# Altium schematic sheet ZynqPL_DDR.SchDoc: ZynqPL_DDR
size A3; Author: Carlos Barreiro; Organization: Escuela Técnica Superior de Ingeniería de Sistemas Informáticos de la Universidad Politécnica de Madrid; Address1: Campus Sur de la Universidad Politécnica de Madrid; Address2: Calle de Alan Turing, s/nº; Address3: Madrid 28031; Address4: España; DocumentNumber: 8; Revision: 1.0; SheetNumber: 8; SheetTotal: 16
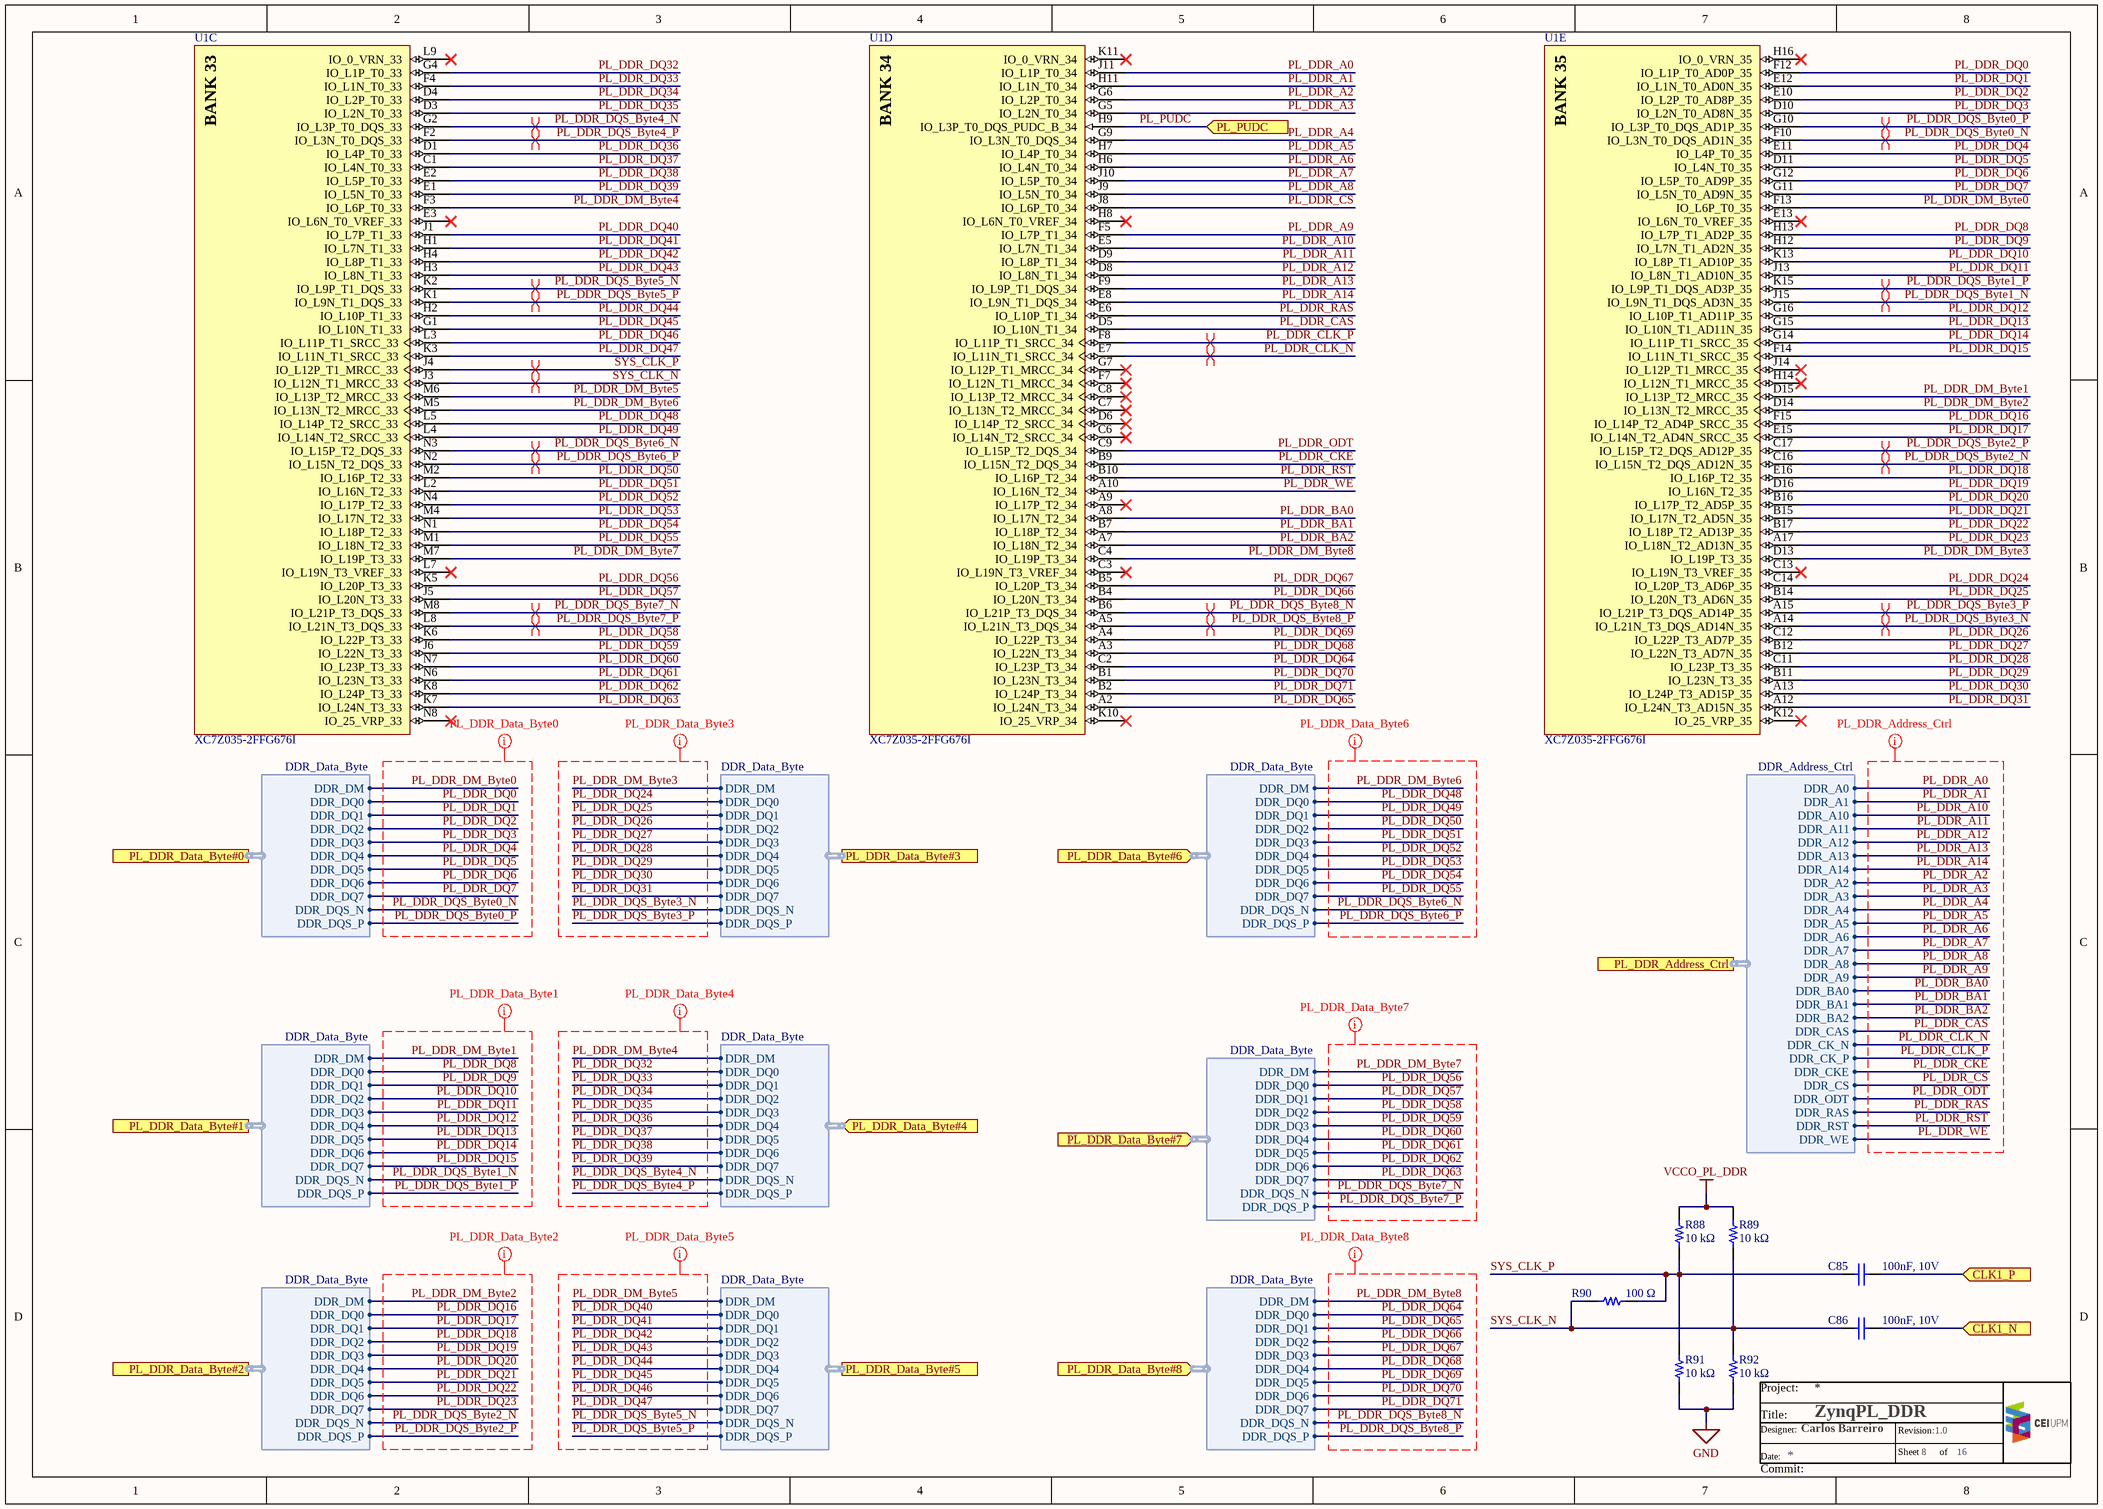
[diagram p0: ZynqPL_DDR.SchDoc]

## Parts
C85  100nF, 10V  [WURTH_WCAP-CSGP_0402]
C86  100nF, 10V  [WURTH_WCAP-CSGP_0402]
R88  10 kΩ  [PANASONIC_ERJ2G_0402]
R89  10 kΩ  [PANASONIC_ERJ2G_0402]
R90  100 Ω  [PANASONIC_ERJ2G_0402]
R91  10 kΩ  [PANASONIC_ERJ2G_0402]
R92  10 kΩ  [PANASONIC_ERJ2G_0402]
U1  XC7Z035-2FFG676I  [XILINX_FBG676]  (parts C,D,E of 13)

## Ports
CLK1_N (in), CLK1_P (in), PL_DDR_Address_Ctrl (harness DDR_Address_Ctrl), PL_DDR_Data_Byte#0 (harness DDR_Data_Byte), PL_DDR_Data_Byte#1 (harness DDR_Data_Byte), PL_DDR_Data_Byte#2 (harness DDR_Data_Byte), PL_DDR_Data_Byte#3 (harness DDR_Data_Byte), PL_DDR_Data_Byte#4 (in, harness DDR_Data_Byte), PL_DDR_Data_Byte#5 (harness DDR_Data_Byte), PL_DDR_Data_Byte#6 (in, harness DDR_Data_Byte), PL_DDR_Data_Byte#7 (in, harness DDR_Data_Byte), PL_DDR_Data_Byte#8 (in, harness DDR_Data_Byte), PL_PUDC (in)

## Harnesses
DDR_Data_Byte: DDR_DM, DDR_DQ0, DDR_DQ1, DDR_DQ2, DDR_DQ3, DDR_DQ4, DDR_DQ5, DDR_DQ6, DDR_DQ7, DDR_DQS_N, DDR_DQS_P
DDR_Address_Ctrl: DDR_A0, DDR_A1, DDR_A10, DDR_A11, DDR_A12, DDR_A13, DDR_A14, DDR_A2, DDR_A3, DDR_A4, DDR_A5, DDR_A6, DDR_A7, DDR_A8, DDR_A9, DDR_BA0, DDR_BA1, DDR_BA2, DDR_CAS, DDR_CK_N, DDR_CK_P, DDR_CKE, DDR_CS, DDR_ODT, DDR_RAS, DDR_RST, DDR_WE

## Nets
GND: R91.1 R92.1
VCCO_PL_DDR: R88.2 R89.2
CLK1_N: C86.2 ; port CLK1_N
CLK1_P: C85.2 ; port CLK1_P
PL_DDR_A0: U1.J11(IO_L1P_T0_34) ; port PL_DDR_Address_Ctrl.DDR_A0
PL_DDR_A1: U1.H11(IO_L1N_T0_34) ; port PL_DDR_Address_Ctrl.DDR_A1
PL_DDR_A2: U1.G6(IO_L2P_T0_34) ; port PL_DDR_Address_Ctrl.DDR_A2
PL_DDR_A3: U1.G5(IO_L2N_T0_34) ; port PL_DDR_Address_Ctrl.DDR_A3
PL_DDR_A4: U1.G9(IO_L3N_T0_DQS_34) ; port PL_DDR_Address_Ctrl.DDR_A4
PL_DDR_A5: U1.H7(IO_L4P_T0_34) ; port PL_DDR_Address_Ctrl.DDR_A5
PL_DDR_A6: U1.H6(IO_L4N_T0_34) ; port PL_DDR_Address_Ctrl.DDR_A6
PL_DDR_A7: U1.J10(IO_L5P_T0_34) ; port PL_DDR_Address_Ctrl.DDR_A7
PL_DDR_A8: U1.J9(IO_L5N_T0_34) ; port PL_DDR_Address_Ctrl.DDR_A8
PL_DDR_A9: U1.F5(IO_L7P_T1_34) ; port PL_DDR_Address_Ctrl.DDR_A9
PL_DDR_A10: U1.E5(IO_L7N_T1_34) ; port PL_DDR_Address_Ctrl.DDR_A10
PL_DDR_A11: U1.D9(IO_L8P_T1_34) ; port PL_DDR_Address_Ctrl.DDR_A11
PL_DDR_A12: U1.D8(IO_L8N_T1_34) ; port PL_DDR_Address_Ctrl.DDR_A12
PL_DDR_A13: U1.F9(IO_L9P_T1_DQS_34) ; port PL_DDR_Address_Ctrl.DDR_A13
PL_DDR_A14: U1.E8(IO_L9N_T1_DQS_34) ; port PL_DDR_Address_Ctrl.DDR_A14
PL_DDR_BA0: U1.A8(IO_L17N_T2_34) ; port PL_DDR_Address_Ctrl.DDR_BA0
PL_DDR_BA1: U1.B7(IO_L18P_T2_34) ; port PL_DDR_Address_Ctrl.DDR_BA1
PL_DDR_BA2: U1.A7(IO_L18N_T2_34) ; port PL_DDR_Address_Ctrl.DDR_BA2
PL_DDR_CAS: U1.D5(IO_L10N_T1_34) ; port PL_DDR_Address_Ctrl.DDR_CAS
PL_DDR_CKE: U1.B9(IO_L15N_T2_DQS_34) ; port PL_DDR_Address_Ctrl.DDR_CKE
PL_DDR_CLK_N: U1.E7(IO_L11N_T1_SRCC_34) ; port PL_DDR_Address_Ctrl.DDR_CK_N
PL_DDR_CLK_P: U1.F8(IO_L11P_T1_SRCC_34) ; port PL_DDR_Address_Ctrl.DDR_CK_P
PL_DDR_CS: U1.J8(IO_L6P_T0_34) ; port PL_DDR_Address_Ctrl.DDR_CS
PL_DDR_DM_Byte0: U1.F13(IO_L6P_T0_35) ; port PL_DDR_Data_Byte#0.DDR_DM
PL_DDR_DM_Byte1: U1.D15(IO_L13P_T2_MRCC_35) ; port PL_DDR_Data_Byte#1.DDR_DM
PL_DDR_DM_Byte2: U1.D14(IO_L13N_T2_MRCC_35) ; port PL_DDR_Data_Byte#2.DDR_DM
PL_DDR_DM_Byte3: U1.D13(IO_L19P_T3_35) ; port PL_DDR_Data_Byte#3.DDR_DM
PL_DDR_DM_Byte4: U1.F3(IO_L6P_T0_33) ; port PL_DDR_Data_Byte#4.DDR_DM
PL_DDR_DM_Byte5: U1.M6(IO_L13P_T2_MRCC_33) ; port PL_DDR_Data_Byte#5.DDR_DM
PL_DDR_DM_Byte6: U1.M5(IO_L13N_T2_MRCC_33) ; port PL_DDR_Data_Byte#6.DDR_DM
PL_DDR_DM_Byte7: U1.M7(IO_L19P_T3_33) ; port PL_DDR_Data_Byte#7.DDR_DM
PL_DDR_DM_Byte8: U1.C4(IO_L19P_T3_34) ; port PL_DDR_Data_Byte#8.DDR_DM
PL_DDR_DQ0: U1.F12(IO_L1P_T0_AD0P_35) ; port PL_DDR_Data_Byte#0.DDR_DQ0
PL_DDR_DQ1: U1.E12(IO_L1N_T0_AD0N_35) ; port PL_DDR_Data_Byte#0.DDR_DQ1
PL_DDR_DQ2: U1.E10(IO_L2P_T0_AD8P_35) ; port PL_DDR_Data_Byte#0.DDR_DQ2
PL_DDR_DQ3: U1.D10(IO_L2N_T0_AD8N_35) ; port PL_DDR_Data_Byte#0.DDR_DQ3
PL_DDR_DQ4: U1.E11(IO_L4P_T0_35) ; port PL_DDR_Data_Byte#0.DDR_DQ4
PL_DDR_DQ5: U1.D11(IO_L4N_T0_35) ; port PL_DDR_Data_Byte#0.DDR_DQ5
PL_DDR_DQ6: U1.G12(IO_L5P_T0_AD9P_35) ; port PL_DDR_Data_Byte#0.DDR_DQ6
PL_DDR_DQ7: U1.G11(IO_L5N_T0_AD9N_35) ; port PL_DDR_Data_Byte#0.DDR_DQ7
PL_DDR_DQ8: U1.H13(IO_L7P_T1_AD2P_35) ; port PL_DDR_Data_Byte#1.DDR_DQ0
PL_DDR_DQ9: U1.H12(IO_L7N_T1_AD2N_35) ; port PL_DDR_Data_Byte#1.DDR_DQ1
PL_DDR_DQ10: U1.K13(IO_L8P_T1_AD10P_35) ; port PL_DDR_Data_Byte#1.DDR_DQ2
PL_DDR_DQ11: U1.J13(IO_L8N_T1_AD10N_35) ; port PL_DDR_Data_Byte#1.DDR_DQ3
PL_DDR_DQ12: U1.G16(IO_L10P_T1_AD11P_35) ; port PL_DDR_Data_Byte#1.DDR_DQ4
PL_DDR_DQ13: U1.G15(IO_L10N_T1_AD11N_35) ; port PL_DDR_Data_Byte#1.DDR_DQ5
PL_DDR_DQ14: U1.G14(IO_L11P_T1_SRCC_35) ; port PL_DDR_Data_Byte#1.DDR_DQ6
PL_DDR_DQ15: U1.F14(IO_L11N_T1_SRCC_35) ; port PL_DDR_Data_Byte#1.DDR_DQ7
PL_DDR_DQ16: U1.F15(IO_L14P_T2_AD4P_SRCC_35) ; port PL_DDR_Data_Byte#2.DDR_DQ0
PL_DDR_DQ17: U1.E15(IO_L14N_T2_AD4N_SRCC_35) ; port PL_DDR_Data_Byte#2.DDR_DQ1
PL_DDR_DQ18: U1.E16(IO_L16P_T2_35) ; port PL_DDR_Data_Byte#2.DDR_DQ2
PL_DDR_DQ19: U1.D16(IO_L16N_T2_35) ; port PL_DDR_Data_Byte#2.DDR_DQ3
PL_DDR_DQ20: U1.B16(IO_L17P_T2_AD5P_35) ; port PL_DDR_Data_Byte#2.DDR_DQ4
PL_DDR_DQ21: U1.B15(IO_L17N_T2_AD5N_35) ; port PL_DDR_Data_Byte#2.DDR_DQ5
PL_DDR_DQ22: U1.B17(IO_L18P_T2_AD13P_35) ; port PL_DDR_Data_Byte#2.DDR_DQ6
PL_DDR_DQ23: U1.A17(IO_L18N_T2_AD13N_35) ; port PL_DDR_Data_Byte#2.DDR_DQ7
PL_DDR_DQ24: U1.C14(IO_L20P_T3_AD6P_35) ; port PL_DDR_Data_Byte#3.DDR_DQ0
PL_DDR_DQ25: U1.B14(IO_L20N_T3_AD6N_35) ; port PL_DDR_Data_Byte#3.DDR_DQ1
PL_DDR_DQ26: U1.C12(IO_L22P_T3_AD7P_35) ; port PL_DDR_Data_Byte#3.DDR_DQ2
PL_DDR_DQ27: U1.B12(IO_L22N_T3_AD7N_35) ; port PL_DDR_Data_Byte#3.DDR_DQ3
PL_DDR_DQ28: U1.C11(IO_L23P_T3_35) ; port PL_DDR_Data_Byte#3.DDR_DQ4
PL_DDR_DQ29: U1.B11(IO_L23N_T3_35) ; port PL_DDR_Data_Byte#3.DDR_DQ5
PL_DDR_DQ30: U1.A13(IO_L24P_T3_AD15P_35) ; port PL_DDR_Data_Byte#3.DDR_DQ6
PL_DDR_DQ31: U1.A12(IO_L24N_T3_AD15N_35) ; port PL_DDR_Data_Byte#3.DDR_DQ7
PL_DDR_DQ32: U1.G4(IO_L1P_T0_33) ; port PL_DDR_Data_Byte#4.DDR_DQ0
PL_DDR_DQ33: U1.F4(IO_L1N_T0_33) ; port PL_DDR_Data_Byte#4.DDR_DQ1
PL_DDR_DQ34: U1.D4(IO_L2P_T0_33) ; port PL_DDR_Data_Byte#4.DDR_DQ2
PL_DDR_DQ35: U1.D3(IO_L2N_T0_33) ; port PL_DDR_Data_Byte#4.DDR_DQ3
PL_DDR_DQ36: U1.D1(IO_L4P_T0_33) ; port PL_DDR_Data_Byte#4.DDR_DQ4
PL_DDR_DQ37: U1.C1(IO_L4N_T0_33) ; port PL_DDR_Data_Byte#4.DDR_DQ5
PL_DDR_DQ38: U1.E2(IO_L5P_T0_33) ; port PL_DDR_Data_Byte#4.DDR_DQ6
PL_DDR_DQ39: U1.E1(IO_L5N_T0_33) ; port PL_DDR_Data_Byte#4.DDR_DQ7
PL_DDR_DQ40: U1.J1(IO_L7P_T1_33) ; port PL_DDR_Data_Byte#5.DDR_DQ0
PL_DDR_DQ41: U1.H1(IO_L7N_T1_33) ; port PL_DDR_Data_Byte#5.DDR_DQ1
PL_DDR_DQ42: U1.H4(IO_L8P_T1_33) ; port PL_DDR_Data_Byte#5.DDR_DQ2
PL_DDR_DQ43: U1.H3(IO_L8N_T1_33) ; port PL_DDR_Data_Byte#5.DDR_DQ3
PL_DDR_DQ44: U1.H2(IO_L10P_T1_33) ; port PL_DDR_Data_Byte#5.DDR_DQ4
PL_DDR_DQ45: U1.G1(IO_L10N_T1_33) ; port PL_DDR_Data_Byte#5.DDR_DQ5
PL_DDR_DQ46: U1.L3(IO_L11P_T1_SRCC_33) ; port PL_DDR_Data_Byte#5.DDR_DQ6
PL_DDR_DQ47: U1.K3(IO_L11N_T1_SRCC_33) ; port PL_DDR_Data_Byte#5.DDR_DQ7
PL_DDR_DQ48: U1.L5(IO_L14P_T2_SRCC_33) ; port PL_DDR_Data_Byte#6.DDR_DQ0
PL_DDR_DQ49: U1.L4(IO_L14N_T2_SRCC_33) ; port PL_DDR_Data_Byte#6.DDR_DQ1
PL_DDR_DQ50: U1.M2(IO_L16P_T2_33) ; port PL_DDR_Data_Byte#6.DDR_DQ2
PL_DDR_DQ51: U1.L2(IO_L16N_T2_33) ; port PL_DDR_Data_Byte#6.DDR_DQ3
PL_DDR_DQ52: U1.N4(IO_L17P_T2_33) ; port PL_DDR_Data_Byte#6.DDR_DQ4
PL_DDR_DQ53: U1.M4(IO_L17N_T2_33) ; port PL_DDR_Data_Byte#6.DDR_DQ5
PL_DDR_DQ54: U1.N1(IO_L18P_T2_33) ; port PL_DDR_Data_Byte#6.DDR_DQ6
PL_DDR_DQ55: U1.M1(IO_L18N_T2_33) ; port PL_DDR_Data_Byte#6.DDR_DQ7
PL_DDR_DQ56: U1.K5(IO_L20P_T3_33) ; port PL_DDR_Data_Byte#7.DDR_DQ0
PL_DDR_DQ57: U1.J5(IO_L20N_T3_33) ; port PL_DDR_Data_Byte#7.DDR_DQ1
PL_DDR_DQ58: U1.K6(IO_L22P_T3_33) ; port PL_DDR_Data_Byte#7.DDR_DQ2
PL_DDR_DQ59: U1.J6(IO_L22N_T3_33) ; port PL_DDR_Data_Byte#7.DDR_DQ3
PL_DDR_DQ60: U1.N7(IO_L23P_T3_33) ; port PL_DDR_Data_Byte#7.DDR_DQ4
PL_DDR_DQ61: U1.N6(IO_L23N_T3_33) ; port PL_DDR_Data_Byte#7.DDR_DQ5
PL_DDR_DQ62: U1.K8(IO_L24P_T3_33) ; port PL_DDR_Data_Byte#7.DDR_DQ6
PL_DDR_DQ63: U1.K7(IO_L24N_T3_33) ; port PL_DDR_Data_Byte#7.DDR_DQ7
PL_DDR_DQ64: U1.C2(IO_L23P_T3_34) ; port PL_DDR_Data_Byte#8.DDR_DQ0
PL_DDR_DQ65: U1.A2(IO_L24N_T3_34) ; port PL_DDR_Data_Byte#8.DDR_DQ1
PL_DDR_DQ66: U1.B4(IO_L20N_T3_34) ; port PL_DDR_Data_Byte#8.DDR_DQ2
PL_DDR_DQ67: U1.B5(IO_L20P_T3_34) ; port PL_DDR_Data_Byte#8.DDR_DQ3
PL_DDR_DQ68: U1.A3(IO_L22N_T3_34) ; port PL_DDR_Data_Byte#8.DDR_DQ4
PL_DDR_DQ69: U1.A4(IO_L22P_T3_34) ; port PL_DDR_Data_Byte#8.DDR_DQ5
PL_DDR_DQ70: U1.B1(IO_L23N_T3_34) ; port PL_DDR_Data_Byte#8.DDR_DQ6
PL_DDR_DQ71: U1.B2(IO_L24P_T3_34) ; port PL_DDR_Data_Byte#8.DDR_DQ7
PL_DDR_DQS_Byte0_N: U1.F10(IO_L3N_T0_DQS_AD1N_35) ; port PL_DDR_Data_Byte#0.DDR_DQS_N
PL_DDR_DQS_Byte0_P: U1.G10(IO_L3P_T0_DQS_AD1P_35) ; port PL_DDR_Data_Byte#0.DDR_DQS_P
PL_DDR_DQS_Byte1_N: U1.J15(IO_L9N_T1_DQS_AD3N_35) ; port PL_DDR_Data_Byte#1.DDR_DQS_N
PL_DDR_DQS_Byte1_P: U1.K15(IO_L9P_T1_DQS_AD3P_35) ; port PL_DDR_Data_Byte#1.DDR_DQS_P
PL_DDR_DQS_Byte2_N: U1.C16(IO_L15N_T2_DQS_AD12N_35) ; port PL_DDR_Data_Byte#2.DDR_DQS_N
PL_DDR_DQS_Byte2_P: U1.C17(IO_L15P_T2_DQS_AD12P_35) ; port PL_DDR_Data_Byte#2.DDR_DQS_P
PL_DDR_DQS_Byte3_N: U1.A14(IO_L21N_T3_DQS_AD14N_35) ; port PL_DDR_Data_Byte#3.DDR_DQS_N
PL_DDR_DQS_Byte3_P: U1.A15(IO_L21P_T3_DQS_AD14P_35) ; port PL_DDR_Data_Byte#3.DDR_DQS_P
PL_DDR_DQS_Byte4_N: U1.G2(IO_L3P_T0_DQS_33) ; port PL_DDR_Data_Byte#4.DDR_DQS_N
PL_DDR_DQS_Byte4_P: U1.F2(IO_L3N_T0_DQS_33) ; port PL_DDR_Data_Byte#4.DDR_DQS_P
PL_DDR_DQS_Byte5_N: U1.K2(IO_L9P_T1_DQS_33) ; port PL_DDR_Data_Byte#5.DDR_DQS_N
PL_DDR_DQS_Byte5_P: U1.K1(IO_L9N_T1_DQS_33) ; port PL_DDR_Data_Byte#5.DDR_DQS_P
PL_DDR_DQS_Byte6_N: U1.N3(IO_L15P_T2_DQS_33) ; port PL_DDR_Data_Byte#6.DDR_DQS_N
PL_DDR_DQS_Byte6_P: U1.N2(IO_L15N_T2_DQS_33) ; port PL_DDR_Data_Byte#6.DDR_DQS_P
PL_DDR_DQS_Byte7_N: U1.M8(IO_L21P_T3_DQS_33) ; port PL_DDR_Data_Byte#7.DDR_DQS_N
PL_DDR_DQS_Byte7_P: U1.L8(IO_L21N_T3_DQS_33) ; port PL_DDR_Data_Byte#7.DDR_DQS_P
PL_DDR_DQS_Byte8_N: U1.B6(IO_L21P_T3_DQS_34) ; port PL_DDR_Data_Byte#8.DDR_DQS_N
PL_DDR_DQS_Byte8_P: U1.A5(IO_L21N_T3_DQS_34) ; port PL_DDR_Data_Byte#8.DDR_DQS_P
PL_DDR_ODT: U1.C9(IO_L15P_T2_DQS_34) ; port PL_DDR_Address_Ctrl.DDR_ODT
PL_DDR_RAS: U1.E6(IO_L10P_T1_34) ; port PL_DDR_Address_Ctrl.DDR_RAS
PL_DDR_RST: U1.B10(IO_L16P_T2_34) ; port PL_DDR_Address_Ctrl.DDR_RST
PL_DDR_WE: U1.A10(IO_L16N_T2_34) ; port PL_DDR_Address_Ctrl.DDR_WE
PL_PUDC: U1.H9(IO_L3P_T0_DQS_PUDC_B_34) ; port PL_PUDC
SYS_CLK_N: C86.1 R89.1 R90.1 R92.2 U1.J3(IO_L12N_T1_MRCC_33)
SYS_CLK_P: C85.1 R88.1 R90.2 R91.2 U1.J4(IO_L12P_T1_MRCC_33)

Not connected (* = marked no-connect by the designer): U1 A9(IO_L17P_T2_34)* C3(IO_L19N_T3_VREF_34)* C6(IO_L14N_T2_SRCC_34)* C7(IO_L13N_T2_MRCC_34)* C8(IO_L13P_T2_MRCC_34)* C13(IO_L19N_T3_VREF_35)* D6(IO_L14P_T2_SRCC_34)* E3(IO_L6N_T0_VREF_33)* E13(IO_L6N_T0_VREF_35)* F7(IO_L12N_T1_MRCC_34)* G7(IO_L12P_T1_MRCC_34)* H8(IO_L6N_T0_VREF_34)* H14(IO_L12N_T1_MRCC_35)* H16(IO_0_VRN_35)* J14(IO_L12P_T1_MRCC_35)* K10(IO_25_VRP_34)* K11(IO_0_VRN_34)* K12(IO_25_VRP_35)* L7(IO_L19N_T3_VREF_33)* L9(IO_0_VRN_33)* N8(IO_25_VRP_33)*

## Layout directives
differential pair: PL_DDR_CLK_N, PL_DDR_CLK_P, PL_DDR_DQS_Byte0_N, PL_DDR_DQS_Byte0_P, PL_DDR_DQS_Byte1_N, PL_DDR_DQS_Byte1_P, PL_DDR_DQS_Byte2_N, PL_DDR_DQS_Byte2_P, PL_DDR_DQS_Byte3_N, PL_DDR_DQS_Byte3_P, PL_DDR_DQS_Byte4_N, PL_DDR_DQS_Byte4_P, PL_DDR_DQS_Byte5_N, PL_DDR_DQS_Byte5_P, PL_DDR_DQS_Byte6_N, PL_DDR_DQS_Byte6_P, PL_DDR_DQS_Byte7_N, PL_DDR_DQS_Byte7_P, PL_DDR_DQS_Byte8_N, PL_DDR_DQS_Byte8_P, SYS_CLK_N, SYS_CLK_P
net class PL_DDR_Address_Ctrl: PL_DDR_A0, PL_DDR_A1, PL_DDR_A2, PL_DDR_A3, PL_DDR_A4, PL_DDR_A5, PL_DDR_A6, PL_DDR_A7, PL_DDR_A8, PL_DDR_A9, PL_DDR_A10, PL_DDR_A11, PL_DDR_A12, PL_DDR_A13, PL_DDR_A14, PL_DDR_BA0, PL_DDR_BA1, PL_DDR_BA2, PL_DDR_CAS, PL_DDR_CKE, PL_DDR_CLK_N, PL_DDR_CLK_P, PL_DDR_CS, PL_DDR_ODT, PL_DDR_RAS, PL_DDR_RST, PL_DDR_WE
net class PL_DDR_Data_Byte6: PL_DDR_DM_Byte6, PL_DDR_DQ48, PL_DDR_DQ49, PL_DDR_DQ50, PL_DDR_DQ51, PL_DDR_DQ52, PL_DDR_DQ53, PL_DDR_DQ54, PL_DDR_DQ55, PL_DDR_DQS_Byte6_N, PL_DDR_DQS_Byte6_P
net class PL_DDR_Data_Byte7: PL_DDR_DM_Byte7, PL_DDR_DQ56, PL_DDR_DQ57, PL_DDR_DQ58, PL_DDR_DQ59, PL_DDR_DQ60, PL_DDR_DQ61, PL_DDR_DQ62, PL_DDR_DQ63, PL_DDR_DQS_Byte7_N, PL_DDR_DQS_Byte7_P
net class PL_DDR_Data_Byte8: PL_DDR_DM_Byte8, PL_DDR_DQ64, PL_DDR_DQ65, PL_DDR_DQ66, PL_DDR_DQ67, PL_DDR_DQ68, PL_DDR_DQ69, PL_DDR_DQ70, PL_DDR_DQ71, PL_DDR_DQS_Byte8_N, PL_DDR_DQS_Byte8_P
net class PL_DDR_Data_Byte3: PL_DDR_DM_Byte3, PL_DDR_DQ24, PL_DDR_DQ25, PL_DDR_DQ26, PL_DDR_DQ27, PL_DDR_DQ28, PL_DDR_DQ29, PL_DDR_DQ30, PL_DDR_DQ31, PL_DDR_DQS_Byte3_N, PL_DDR_DQS_Byte3_P
net class PL_DDR_Data_Byte4: PL_DDR_DM_Byte4, PL_DDR_DQ32, PL_DDR_DQ33, PL_DDR_DQ34, PL_DDR_DQ35, PL_DDR_DQ36, PL_DDR_DQ37, PL_DDR_DQ38, PL_DDR_DQ39, PL_DDR_DQS_Byte4_N, PL_DDR_DQS_Byte4_P
net class PL_DDR_Data_Byte5: PL_DDR_DM_Byte5, PL_DDR_DQ40, PL_DDR_DQ41, PL_DDR_DQ42, PL_DDR_DQ43, PL_DDR_DQ44, PL_DDR_DQ45, PL_DDR_DQ46, PL_DDR_DQ47, PL_DDR_DQS_Byte5_N, PL_DDR_DQS_Byte5_P
net class PL_DDR_Data_Byte2: PL_DDR_DM_Byte2, PL_DDR_DQ16, PL_DDR_DQ17, PL_DDR_DQ18, PL_DDR_DQ19, PL_DDR_DQ20, PL_DDR_DQ21, PL_DDR_DQ22, PL_DDR_DQ23, PL_DDR_DQS_Byte2_N, PL_DDR_DQS_Byte2_P
net class PL_DDR_Data_Byte1: PL_DDR_DM_Byte1, PL_DDR_DQ8, PL_DDR_DQ9, PL_DDR_DQ10, PL_DDR_DQ11, PL_DDR_DQ12, PL_DDR_DQ13, PL_DDR_DQ14, PL_DDR_DQ15, PL_DDR_DQS_Byte1_N, PL_DDR_DQS_Byte1_P
net class PL_DDR_Data_Byte0: PL_DDR_DM_Byte0, PL_DDR_DQ0, PL_DDR_DQ1, PL_DDR_DQ2, PL_DDR_DQ3, PL_DDR_DQ4, PL_DDR_DQ5, PL_DDR_DQ6, PL_DDR_DQ7, PL_DDR_DQS_Byte0_N, PL_DDR_DQS_Byte0_P

## Notes on the sheet
- Project:
- Title:
- Date:
- Designer:
- Sheet
- Revision:
- of
- Commit:
- (in symbol XC7Z035-2FFG676I, part C) BANK 33
- (in symbol XC7Z035-2FFG676I, part D) BANK 34
- (in symbol XC7Z035-2FFG676I, part E) BANK 35

## Library data of the parts
C85 C86 = 885012205018: WCAP-CSGP Multilayer Ceramic Chip Capacitor, General Purpose, size 0402, X7R, 100nF, 10V; Manufacturer: Wurth Elektronik; Rated Voltage: 10VDC; Isolation Resistance  min.: 5GOhm; Capacitance Tolerance: +/-10%; Dissipation Factor max.: 5%; Technical Reference: X7R0402104K010DFCT10000; ComponentLink1Description: Manufacturer; ComponentLink1URL: http://www.we-online.de; ComponentLink2Description: Datasheet; ComponentLink2URL: https://www.we-online.com/catalog/datasheet/885012205018.pdf; Operating Temperature: -55 to +125degC; Packaging: Tape and Reel; Manufacturer Part Number: 885012205018; Published Date: April 2021; Ceramic Type: X7R; Height: 0.5mm; Mounting Technology: SMT; Size: 0402; Capacitance: 100nF; Q-Factor min.: -
R88 R89 R91 R92 = ERJ2RKF1002X: General Purpose Thick Film Chip Resistors; Manufacturer: Panasonic; Power (0402): 0.1 W; Limiting Voltage (0402): 50; Maximum Voltage (0402): 100; Resistance Range (Ω): 1Ω to 100MΩ; AEC 200: Grade 0; Size (0402): 2GE; ComponentLink1Description: Catalog; ComponentLink1URL: https://industrial.panasonic.com/ww/products/pt/general-purpose-chip-resistors/models?op=search&model_status_current=1&page=0#model-list-search-results; Series: ERJ; Temperature Range (ºC): -55 to +155; Supplier 1: Digi-Key; Supplier 2: Mouser; Supplier Part Number 1: P10.0KLCT-ND; Supplier Part Number 2: 667-ERJ-2RKF1002X
R90 = ERJ2GEJ101X: General Purpose Thick Film Chip Resistors; Manufacturer: Panasonic; Power (0402): 0.1 W; Limiting Voltage (0402): 50; Maximum Voltage (0402): 100; Resistance Range (Ω): 1Ω to 100MΩ; AEC 200: Grade 0; Size (0402): 2GE; ComponentLink1Description: Catalog; ComponentLink1URL: https://industrial.panasonic.com/ww/products/pt/general-purpose-chip-resistors/models?op=search&model_status_current=1&page=0#model-list-search-results; Series: ERJ; Temperature Range (ºC): -55 to +155; Supplier 1: Digi-Key; Supplier 2: Mouser; Supplier Part Number 2: 667-ERJ-2GEJ101X; Supplier Part Number 1: P100JTR-ND
U1 = XC7Z035-2FFG676I: 667 MHz Zynq™-7000 AP SoC, 130 PS I/O, 254 FPGA I/O, 676-Ball BGA, Speed Grade 1, Commercial Grade, Pb-Free; PartNumber: XC7Z035-2FBG676I; LUTs: 171,900; Extensible Block RAM (# 36Kb Blocks): 17.6Mb (500); Speed Grade: -2; Flip Flops: 343,800; ComponentLink5Description: Packaging and Pinout; ComponentLink4Description: Package File; ComponentLink5URL: http://www.xilinx.com/support/documentation/user_guides/ug865-Zynq-7000-Pkg-Pinout.pdf; Generic Part Number: XC7Z035; ComponentLink1Description: Datasheet; ComponentLink2Description: Package Specification; ComponentLink3URL: http://www.xilinx.com/support/documentation/data_sheets/ds191-XC7Z030-XC7Z045-data-sheet.pdf; ComponentLink1URL: http://www.xilinx.com/support/documentation/data_sheets/ds190-Zynq-7000-Overview.pdf; ComponentLink6Description: PCB and Layout Guide; Package: FBG676; ComponentLink3Description: DC and AC Switching Characteristics; ComponentLink6URL: http://www.xilinx.com/support/documentation/user_guides/ug483_7Series_PCB.pdf; RoHS: Pb-Free; ComponentLink4URL: http://www.xilinx.com/support/packagefiles/z7packages/xc7z030fbg676pkg.txt; ComponentLink2URL: http://www.xilinx.com/support/documentation/user_guides/ug475_7Series_Pkg_Pinout.pdf; PackageDescription: Flip-Chip Lidless BGA, Body 27 x 27 mm, 1.0 mm Pitch; Supplier 1: Digi-Key; Supplier 2: Mouser; Supplier Part Number 1: XC7Z035-2FFG676I-ND; Supplier Part Number 2: 217-XC7Z035-2FFG676I